# EAGLE design OxFloodNet_sensor (EAGLE 8.6.0)
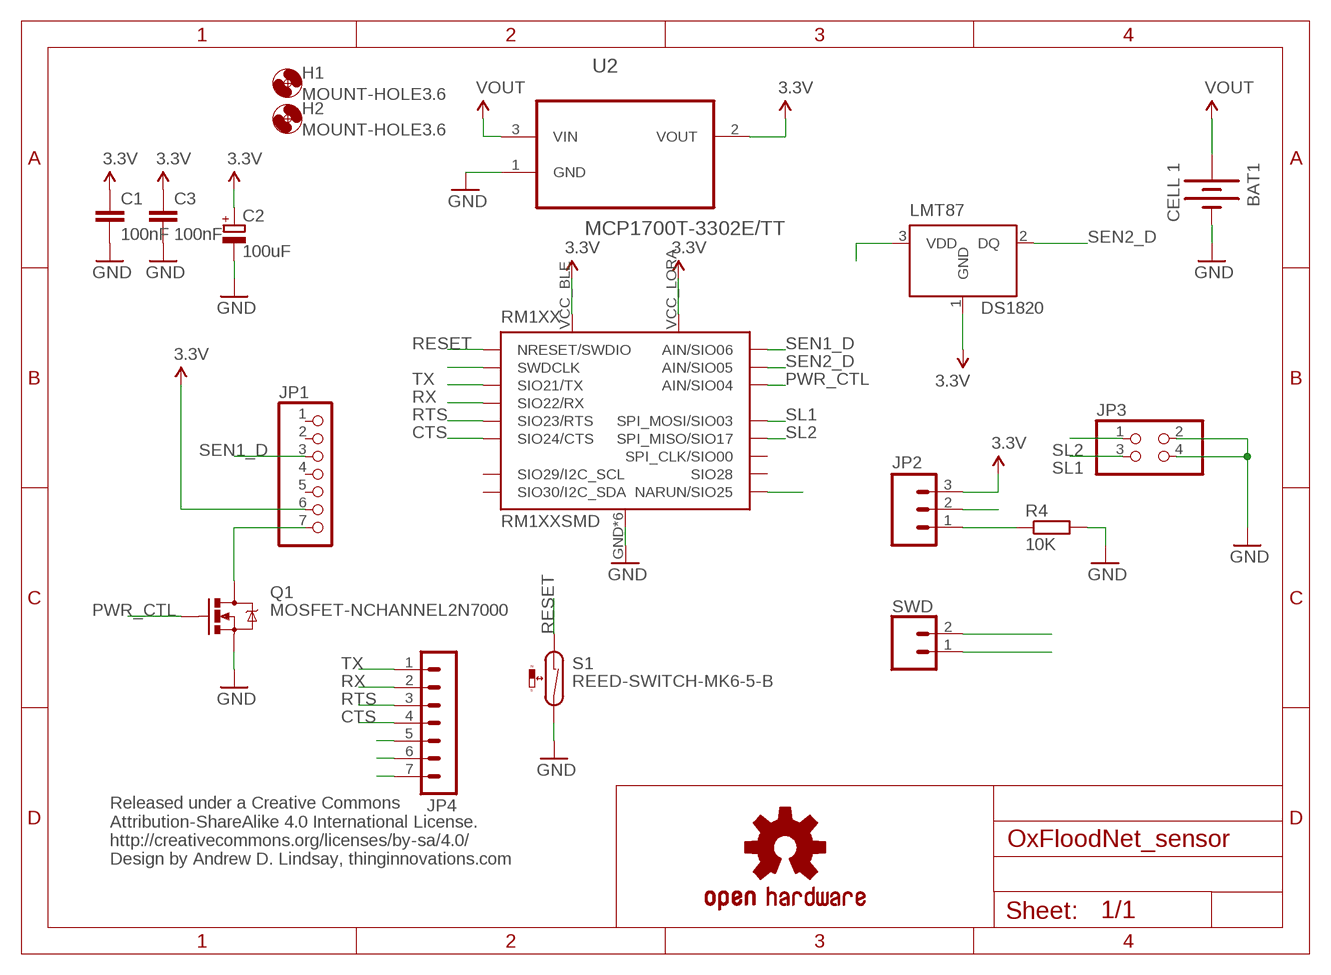
[diagram p0: schematic, sheet 1]

## Parts
BAT1  CELL 1  BATTERYAA  [BATTERY-AA]
C1  100nF  C-EU025-024X044  [C025-024X044]
C2  100uF  CPOL-EUE2,5-6E  [E2,5-6E]
C3  100nF  C-EU025-024X044  [C025-024X044]
H1  MOUNT-HOLE3.6  [3,6]
H2  MOUNT-HOLE3.6  [3,6]
JP1  1X07  [1X07]
JP2  M03PTH  [1X03]
JP3  2X02  [2X02]
JP4  MA07-1  [MA07-1]
LMT87  DS1820  [TO-92]
LOGO1  OSHW-LOGOM  [OSHW-LOGO-M]
Q1  MOSFET-NCHANNEL2N7000  [TO-92]
R4  10K  R-EU_R0603  [R0603]
RM1XX  RM1XXSMD  [RM1XX]
S1  REED-SWITCH-MK6-5-B  [MK6-5]
SWD  CONN_02  [1X02]
U2  MCP1700T-3302E/TT  [SOT95P237X112-3N]

## Nets
3.3V [3.3V]: C1.1 C2.+ C3.1 JP1.6 JP2.3 JP4.6 LMT87.1(GND) RM1XX.VCC_BLE RM1XX.VCC_LORA U2.2(VOUT)
ARUN: JP2.2 RM1XX.SIO25(NARUN/SIO25)
CTS: JP4.4 RM1XX.SIO24(SIO24/CTS)
GND: BAT1.GND@1(-) C1.2 C2.- C3.2 JP3.2 JP3.4 JP4.5 Q1.1(S) R4.2 RM1XX.GND RM1XX.GND1(GND) RM1XX.GND2(GND) RM1XX.GND3(GND) RM1XX.GND4(GND) RM1XX.GND5(GND) S1.2 U2.1(GND)
N$1: JP2.1 R4.1
N$2: JP1.7 LMT87.3(VDD) Q1.3(D)
PWR_CTL: Q1.2(G) RM1XX.SIO04(AIN/SIO04)
RESET: RM1XX.RESET(NRESET/SWDIO) S1.1 SWD.2
RTS: JP4.3 RM1XX.SIO23(SIO23/RTS)
RX: JP4.2 RM1XX.SIO22(SIO22/RX)
SEN1_D: JP1.3 RM1XX.SIO06(AIN/SIO06)
SEN2_D: LMT87.2(DQ) RM1XX.SIO05(AIN/SIO05)
SL1: JP3.3 RM1XX.SIO03(SPI_MOSI/SIO03)
SL2: JP3.1 RM1XX.SIO17(SPI_MISO/SIO17)
SWDCLK: RM1XX.SWDCLK SWD.1
TX: JP4.1 RM1XX.SIO21(SIO21/TX)
VOUT [3.3V]: BAT1.PWR@1(+) JP4.7 U2.3(VIN)
Unconnected: JP1.1 JP1.2 JP1.4 JP1.5 RM1XX.SIO00(SPI_CLK/SIO00) RM1XX.SIO28 RM1XX.SIO29(SIO29/I2C_SCL) RM1XX.SIO30(SIO30/I2C_SDA)

## Notes on the sheet
- Released under a Creative Commons
  Attribution-ShareAlike 4.0 International License.
  http://creativecommons.org/licenses/by-sa/4.0/
  Design by Andrew D. Lindsay, thinginnovations.com

## Library data of the parts
BAT1 = SparkFun-Electromechanical:BATTERY: Battery Holders Various common sizes : AA, AAA, 20mm coin cell and 12mm coin cell. 20MM_4LEGS, BATT-10373
C1 C3 = rcl:C-EU: CAPACITOR, European symbol
C2 = rcl:CPOL-EU: POLARIZED CAPACITOR, European symbol
H1 H2 = holes:MOUNT-HOLE: MOUNTING HOLE with drill center marker
JP1 = pinhead:1X07: PIN HEADER
JP2 = SparkFun-Connectors:M03: Header 3 Standard 3-pin 0.1" header. Use with straight break away headers (SKU : PRT-00116), right angle break away headers (PRT-00553), swiss pins (PRT-00743), machine pins (PRT-00117), and female headers (PRT-00115). Molex polarized connector foot print use with SKU : PRT-08232 with associated crimp pins and housings.
JP3 = pinhead:2X02: PIN HEADER
JP4 = con-lstb:MA07-1: PIN HEADER; OC_FARNELL: unknown; OC_NEWARK: unknown
LMT87 = DS1820:DS1820: DS1820 - 1-Wire Digital Thermometer
LOGO1 = SparkFun-Aesthetics:OSHW-LOGO: Open Source Hardware Logo This logo indicates the piece of hardware it is found on incorporates a OSHW license and/or adheres to the definition of open source hardware found here: http://freedomdefined.org/OSHW
Q1 = SparkFun-DiscreteSemi:MOSFET-NCHANNEL: Common NMOSFET Parts MFG P/N Store ID Prod ID FDD8780 TRANS-09984 SI7820DN TRANS-11055 FDS6630A IC-08089 2N7002PW TRANS-11151 FQP30N06L COM-10213 TRANS-10060 BSS123LT1G TRANS-08345 BSS138 TRANS-00830 BS170 2N7000
R4 = rcl:R-EU_: RESISTOR, European symbol; SPICEPREFIX: R
RM1XX = _c2h:RM1XX
S1 = switch-reed:REED-SWITCH-: Reed Sensor; MF: MEDER; MPN: MK6-5-B; OC_FARNELL: 1079479
SWD = SparkFun-Connectors:CONN_02: Multi connection point. Often used as Generic Header-pin footprint for 0.1 inch spaced/style header connections On any of the 0.1 inch spaced packages, you can populate with these: Break Away Headers - Straight <https://www.sparkfun.com/products/116> (PRT-00116) Break Away Male Headers - Right Angle <https://www.sparkfun.com/products/553> (PRT-00553) Female Headers <https://www.sparkfun.com/products/115> (PRT-00115) Break Away Headers - Machine Pin <https://www.sparkfun.com/products/117> (PRT-00117) Break Away Female Headers - Swiss Machine Pin <https://www.sparkfun.com/products/743> (PRT-00743) For SCREWTERMINALS and SPRING TERMINALS visit here: Screw Terimnals on SparkFun.com <https://www.sparkfun.com/search/results?term=Screw+Terminals> (5mm/3.5mm/2.54mm spacing) This device is also useful as a general connection point to wire up your design to another part of your project. Our various solder wires solder well into these plated through hole pads. Hook-Up Wire - Assortment (Stranded, 22 AWG) <https://www.sparkfun.com/products/11375> (PRT-11375) Hook-Up Wire - Assortment (Solid Core, 22 AWG) <https://www.sparkfun.com/products/11367> (PRT-11367) View the entire wire category on our website here <https://www.sparkfun.com/categories/141> Special notes: Molex polarized connector foot print use with: PRT-08233 with associated crimp pins and housings. 2.54_SCREWTERM for use with PRT-10571. 3.5mm Screw Terminal footprints for PRT-08084 5mm Screw Terminal footprints for use with PRT-08432
U2 = Ava:MCP1700T-3302E/TT: Low Quiescent Current LDO; MPN: MCP1700T-3302E/TT; OC_FARNELL: 1296592; OC_NEWARK: 88H9817; PACKAGE: SOT23-3; SUPPLIER: Microchip

## Net classes
0 default: width 0.2 mm, clearance 0.205 mm
1 3.3V: width 0.4 mm, clearance 0.25 mm

## Board
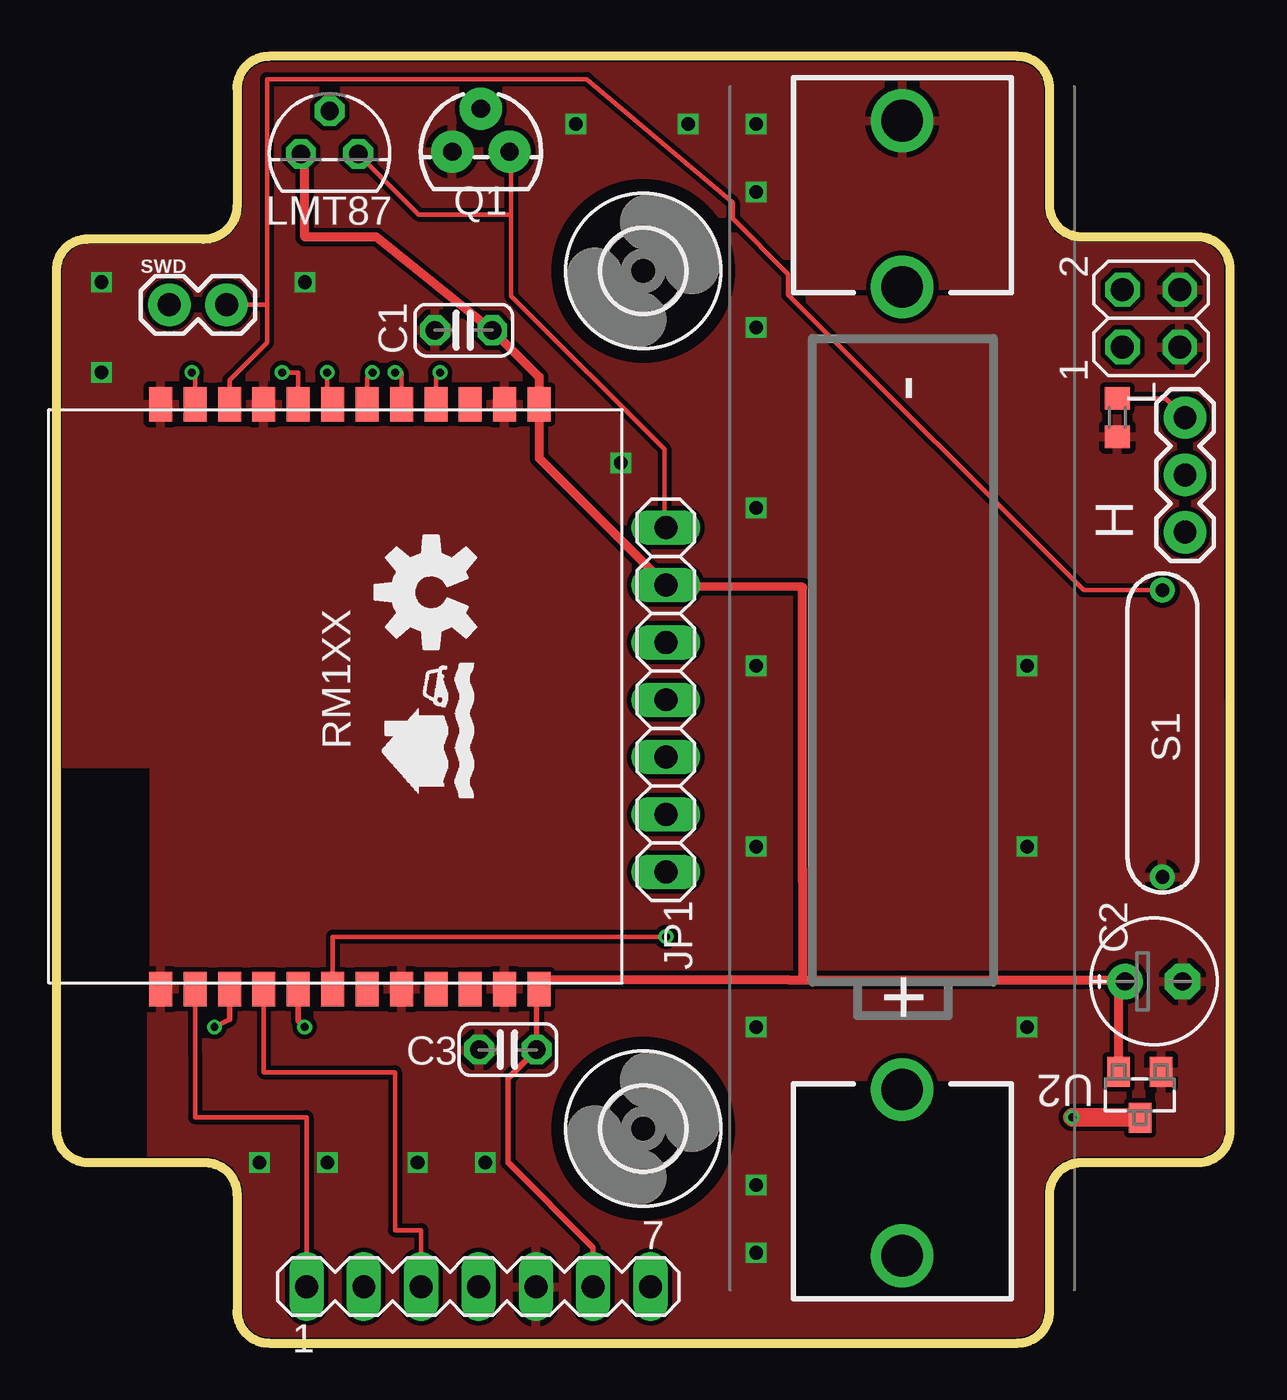
[diagram p1: board, top side]
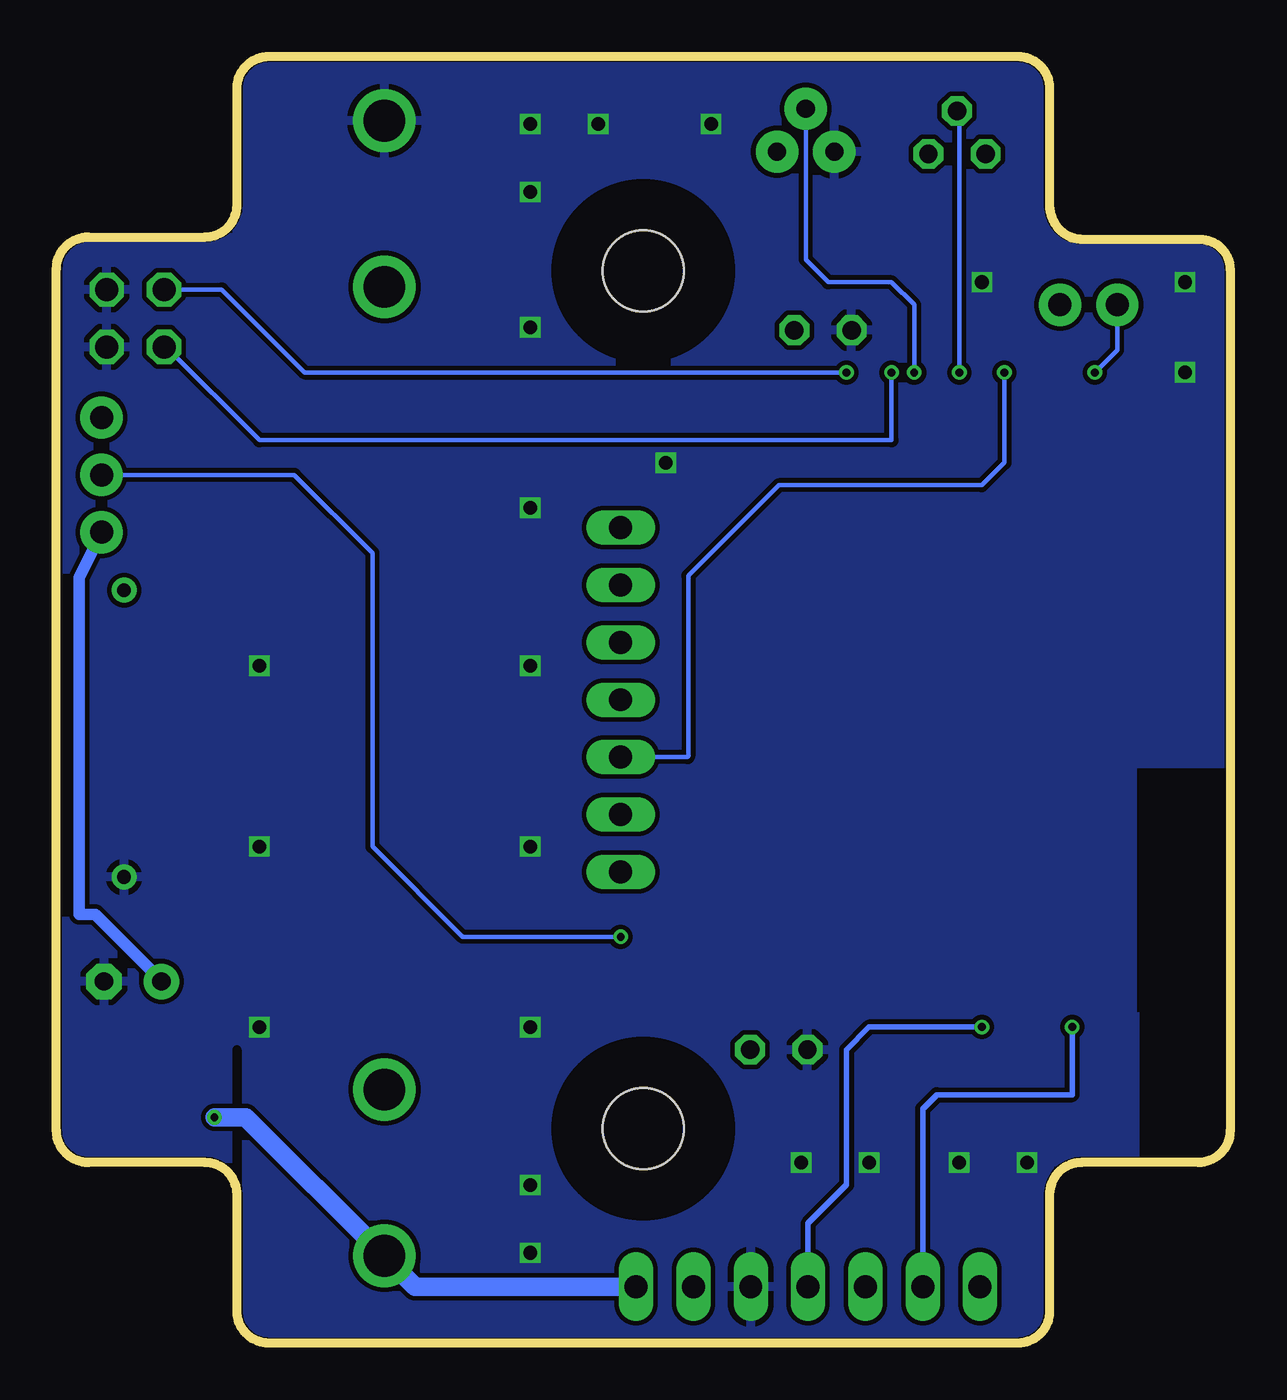
[diagram p2: board, bottom side, seen from below]

Size 52 x 57 mm. Coordinates in mm from the lower left corner, seen from the top.
Outline: 9.41,0 42.59,0 arc90 44,1.41 44,6.59 arc-90 45.41,8 50.59,8 arc90 52,9.42 51.98,47.61 arc90 50.55,49.04 45.39,49.04 arc-90 44,50.43 44,55.59 arc90 42.59,57 9.41,57 arc90 8,55.59 8,50.4 arc-90 6.54,48.94 1.37,48.94 arc90 0,47.57 0,9.41 arc90 1.41,8 6.59,8 arc-90 8,6.59 8,1.41 arc90 9.41,0
Copper layers (1*16): Top 0.035mm / dielectric 1.5mm / Bottom 0.035mm
Design rules "SeeedStudio_2layer_DRU_no_angle_20140221": minimum track width 6mil, minimum drill 12mil, track to track 6mil, track to pad 6mil, pad to pad 6mil, via to via 6mil, smd to smd 0mil, copper to edge 10mil, drill to drill 10mil, minimum pad ring 10mil, minimum via ring 6mil, stop-mask expansion 2mil, vias tented up to drill 100mil, thermal gap 10mil
tRestrict: area 0,8 to 4,15
bRestrict: area 44,1 to 44,13; area 0,8 to 4,15
Milling: 24 lines

### Footprints (pad centres in the part's own frame; a part is rotated, then mirrored left to right if it is on the bottom)
BATTERY-AA = drill 1.854: GND@1 25.146,0; GND@2 17.78,0; PWR@1 -25.146,0; PWR@2 -17.78,0
C025-024X044 = drill 0.813 octagon: 1 -1.27,0; 2 1.27,0
E2,5-6E = drill 0.813 pad 1.575: + -1.27,0 | drill 0.813 pad 1.575 octagon: - 1.27,0
3,6 = hole 3.6: 0,0
1X07 = drill 1.016 long: 1 -7.62,0; 2 -5.08,0; 3 -2.54,0; 4 0,0; 5 2.54,0; 6 5.08,0; 7 7.62,0
1X03 = drill 1.016 pad 1.88: 1 0,0; 2 2.54,0; 3 5.08,0
2X02 = drill 1.016 octagon: 1 -1.27,-1.27; 2 -1.27,1.27; 3 1.27,-1.27; 4 1.27,1.27
MA07-1 = drill 1.016 long: 1 -7.62,0; 2 -5.08,0; 3 -2.54,0; 4 0,0; 5 2.54,0; 6 5.08,0; 7 7.62,0
TO-92 = drill 0.813 pad 1.27 octagon: 1 -1.27,0; 2 0,1.905; 3 1.27,0
TO-92' = drill 0.813 pad 1.88: 1 -1.27,0; 2 0,1.905; 3 1.27,0
R0603 = smd 1 x 1.1: 1 -0.85,0; 2 0.85,0
RM1XX = smd 1.524 x 1.016: GND -12.319,8.382; GND1 13.589,8.382; GND2 -12.319,-2.286; GND3 -12.319,-6.858; GND4 13.589,-6.858; GND5 13.589,3.81; RESET 13.589,5.334; SIO00 13.589,-5.334; SIO03 13.589,-2.286; SIO04 13.589,-0.762; SIO05 13.589,0.762; SIO06 13.589,2.286; SIO17 13.589,-3.81; SIO21 -12.319,6.858; SIO22 -12.319,5.334; SIO23 -12.319,3.81; SIO24 -12.319,2.286; SIO25 -12.319,0.762; SIO28 -12.319,-0.762; SIO29 -12.319,-3.81; SIO30 -12.319,-5.334; SWDCLK 13.589,6.858; VCC_BLE -12.319,-8.382; VCC_LORA 13.589,-8.382
MK6-5 = drill 0.6 pad 1.016: 1 -6.35,0; 2 6.35,0
1X02 = drill 1.016 pad 1.88: 1 0,0; 2 2.54,0
SOT95P237X112-3N = smd 0.991 x 1.321: 1 -0.94,-1.016; 2 0.94,-1.016; 3 0,1.016

### Placement (x,y rotation side)
BAT1  37.47,29.01 90 top
C1  18.04,44.87 180 top
C2  48.62,16.02 0 top
C3  20,13 180 top
H1  26,47.5 0 top
H2  26,9.5 0 top
JP1  27,28.5 90 top
JP2  50,41 270 top
JP3  48.5,45.4 270 top
JP4  18.7,2.5 0 top
LMT87  12.1,52.68 0 top
LOGO1  16.6,33.26 90 top
Q1  MOSFET-NCHANNEL2N7000  [TO-92']  18.8,52.78 0 top
R4  47,41 270 top
RM1XX  13,28 90 top
S1  49,27 270 top
SWD  5,46 0 top
U2  48,11 180 top

### Tracks (layer width: path | path; a pad name or v marks a point on that pad's centre or on a via)
3.3V
  Top 0.254: RM1XX.VCC_BLE 21.27,15.57 C3.1 20,11.73 20,8 23.78,4.22 JP4.6
  Top 0.4: 33.06,20.44 33.06,21 33.06,33.49 27.03,33.51 JP1.6 | 32.4,16.1 33,16.1 47.28,16.1 C2.+
  Top 0.406: U2.2 47.06,15.88 47.28,16.1 | JP1.6 21.38,39.2 RM1XX.VCC_LORA 21.38,42.8 C1.1 14.18,49 11,49 11,52.68 LMT87.1 | RM1XX.VCC_BLE 21.38,16.1 32.4,16.1 | 33.06,21 33.06,16.16 33,16.1
  Bottom 0.4: 47.28,16 C2.+
  Bottom 0.508: JP2.3 51,33.92 51,19 50.29,19 47.28,16
ARUN  (via drill 0.35)
  Top 0.2: RM1XX.SIO25 12.24,18 v27,18
  Bottom 0.2: v27,18 34,18 38,22 38,35 41.46,38.46 JP2.2
CTS  (via drill 0.35)
  Top 0.254: RM1XX.SIO24 10.71,14.29 v11,14
  Bottom 0.254: v11,14 16,14 17,13 17,7 18.7,5.3 JP4.4
GND  (via drill 0.6)
  other vias: 43,14 2,47 43,30 31,22 31,14 31,30 31,51 31,54 23,54 28,54 31,37 43,22 19,8 9,8 25,39 31,4 31,7 31,45 11,47 2,43 12,8 16,8
  pour Top: 8,0 44,0 44,8 52,8 52,49 44,49 44,57 8,57 8,49 0,49 0,8 8,8
  pour Bottom: 8,0 44,0 44,8 52,8 52,49 44,49 44,57 8,57 8,49 0,49 0,8 8,8
N$1
  Top 0.2: R4.1 49.15,41.85 JP2.1
N$2
  Top 0.2: JP1.7 26.93,36.15 26.93,39.6 20.15,46.38 20.15,50 20.15,52.75 Q1.3
  Top 0.203: LMT87.3 16.05,50 20.15,50
PWR_CTL  (via drill 0.35)
  Top 0.203: RM1XX.SIO04 13.76,42.76 v14,43
  Bottom 0.2: 18.8,48 Q1.2
  Bottom 0.203: v14,43 14,46 15,47 17.8,47 18.8,48
RESET
  Top 0.2: 29.97,49.8 29.97,50.51 23.49,55.99 9.33,55.99 | RM1XX.RESET 7.67,42.67 | 9.33,46 SWD.2
  Top 0.203: 7.67,42.67 9.33,44.33 9.33,46 9.33,55.99 | 29.97,49.8 32.41,47.36 32.41,46.44 45.51,33.35 S1.1
RTS
  Top 0.2: RM1XX.SIO23 9.19,12 15,12 15,5 16.16,5 JP4.3
RX  (via drill 0.35)
  Top 0.254: RM1XX.SIO22 7.67,14.33 v7,14
  Bottom 0.254: JP4.2 13.62,10.38 13,11 7,11 v7,14
SEN1_D  (via drill 0.35)
  Top 0.2: v10,43 10.71,43 RM1XX.SIO06
  Bottom 0.203: v10,43 10,39 11,38 20,38 24,34 24,26 24.04,25.96 JP1.3
SEN2_D  (via drill 0.35)
  Top 0.2: v12,43 12,41.83 RM1XX.SIO05
  Top 0.203: 12.1,41.73 RM1XX.SIO05
  Bottom 0.2: v12,43 12,54.48 LMT87.2
SL1  (via drill 0.35)
  Top 0.2: v15,43 15.29,43 RM1XX.SIO03
  Bottom 0.2: v15,43 15,40 43,40 47.13,44.13 JP3.3
SL2  (via drill 0.35)
  Top 0.2: v17,43 16.81,42.81 RM1XX.SIO17
  Bottom 0.2: JP3.1 44.67,46.67 41,43 v17,43
SWDCLK  (via drill 0.35)
  Top 0.203: RM1XX.SWDCLK 6.14,42.86 v6,43
  Bottom 0.203: v6,43 5,44 SWD.1
TX
  Top 0.2: 11.08,10 JP4.1
  Top 0.203: RM1XX.SIO21 6.14,13 6.14,12.82 6.14,10 11.08,10
VOUT  (via drill 0.35)
  Top 0.813: v45,10 48,10 U2.3
  Bottom 0.813: v45,10 43.61,10 BAT1.PWR@1 36.11,2.5 JP4.7

### Text on the board
tNames: 2 | 1 | L | H
tDocu: - | GND | Tadiran 3.6V Battery / Observe correct polarity | + | DBG